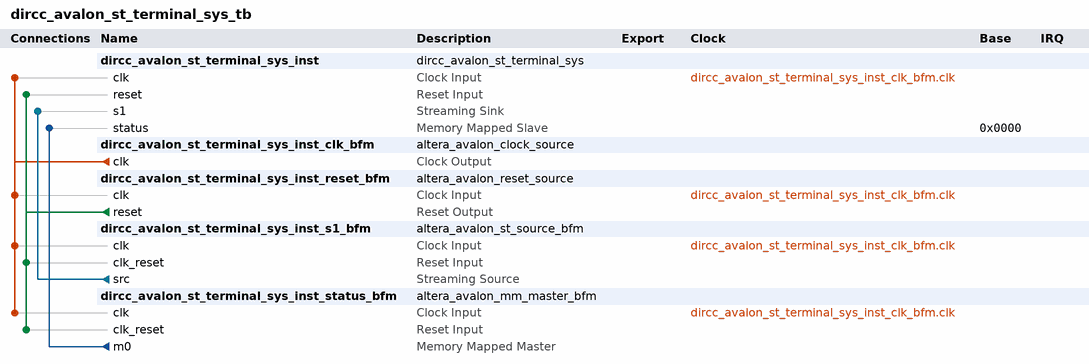
[diagram p0: system contents]
# Platform Designer (Qsys) system dircc_avalon_st_terminal_sys_tb, Cyclone V 5CSEMA5F31C6
# Parameters at their usual value, and those the tool derives, are not listed.
package require -exact qsys 16.1
create_system dircc_avalon_st_terminal_sys_tb
set_project_property DEVICE_FAMILY {Cyclone V}
set_project_property DEVICE 5CSEMA5F31C6

add_instance dircc_avalon_st_terminal_sys_inst dircc_avalon_st_terminal_sys 1.0

add_instance dircc_avalon_st_terminal_sys_inst_clk_bfm altera_avalon_clock_source 16.1

add_instance dircc_avalon_st_terminal_sys_inst_reset_bfm altera_avalon_reset_source 16.1
set_instance_parameter_value dircc_avalon_st_terminal_sys_inst_reset_bfm ASSERT_HIGH_RESET 0
set_instance_parameter_value dircc_avalon_st_terminal_sys_inst_reset_bfm INITIAL_RESET_CYCLES 50

add_instance dircc_avalon_st_terminal_sys_inst_s1_bfm altera_avalon_st_source_bfm 16.1
set_instance_parameter_value dircc_avalon_st_terminal_sys_inst_s1_bfm ST_CHANNEL_W 1
set_instance_parameter_value dircc_avalon_st_terminal_sys_inst_s1_bfm ST_ERROR_W 1
set_instance_parameter_value dircc_avalon_st_terminal_sys_inst_s1_bfm ST_MAX_CHANNELS 0
set_instance_parameter_value dircc_avalon_st_terminal_sys_inst_s1_bfm ST_NUMSYMBOLS 4
set_instance_parameter_value dircc_avalon_st_terminal_sys_inst_s1_bfm ST_SYMBOL_W 8
set_instance_parameter_value dircc_avalon_st_terminal_sys_inst_s1_bfm USE_CHANNEL 0
set_instance_parameter_value dircc_avalon_st_terminal_sys_inst_s1_bfm USE_EMPTY 1
set_instance_parameter_value dircc_avalon_st_terminal_sys_inst_s1_bfm USE_ERROR 0
set_instance_parameter_value dircc_avalon_st_terminal_sys_inst_s1_bfm USE_PACKET 1
set_instance_parameter_value dircc_avalon_st_terminal_sys_inst_s1_bfm USE_READY 1
set_instance_parameter_value dircc_avalon_st_terminal_sys_inst_s1_bfm USE_VALID 1

add_instance dircc_avalon_st_terminal_sys_inst_status_bfm altera_avalon_mm_master_bfm 16.1
set_instance_parameter_value dircc_avalon_st_terminal_sys_inst_status_bfm ADDRESS_UNITS WORDS
set_instance_parameter_value dircc_avalon_st_terminal_sys_inst_status_bfm AV_ADDRESS_W 2
set_instance_parameter_value dircc_avalon_st_terminal_sys_inst_status_bfm AV_ALWAYS_BURST_MAX_BURST 0
set_instance_parameter_value dircc_avalon_st_terminal_sys_inst_status_bfm AV_BURSTCOUNT_W 1
set_instance_parameter_value dircc_avalon_st_terminal_sys_inst_status_bfm AV_BURST_BNDR_ONLY 0
set_instance_parameter_value dircc_avalon_st_terminal_sys_inst_status_bfm AV_BURST_LINEWRAP 0
set_instance_parameter_value dircc_avalon_st_terminal_sys_inst_status_bfm AV_CONSTANT_BURST_BEHAVIOR 1
set_instance_parameter_value dircc_avalon_st_terminal_sys_inst_status_bfm AV_FIX_READ_LATENCY 0
set_instance_parameter_value dircc_avalon_st_terminal_sys_inst_status_bfm AV_MAX_PENDING_WRITES 0
set_instance_parameter_value dircc_avalon_st_terminal_sys_inst_status_bfm AV_NUMSYMBOLS 2
set_instance_parameter_value dircc_avalon_st_terminal_sys_inst_status_bfm AV_READRESPONSE_W 1
set_instance_parameter_value dircc_avalon_st_terminal_sys_inst_status_bfm AV_READ_WAIT_TIME 1
set_instance_parameter_value dircc_avalon_st_terminal_sys_inst_status_bfm AV_WRITERESPONSE_W 1
set_instance_parameter_value dircc_avalon_st_terminal_sys_inst_status_bfm USE_BURSTCOUNT 0
set_instance_parameter_value dircc_avalon_st_terminal_sys_inst_status_bfm USE_BYTE_ENABLE 0
set_instance_parameter_value dircc_avalon_st_terminal_sys_inst_status_bfm USE_READ 1
set_instance_parameter_value dircc_avalon_st_terminal_sys_inst_status_bfm USE_READ_DATA 1
set_instance_parameter_value dircc_avalon_st_terminal_sys_inst_status_bfm USE_READ_DATA_VALID 0
set_instance_parameter_value dircc_avalon_st_terminal_sys_inst_status_bfm USE_WAIT_REQUEST 0
set_instance_parameter_value dircc_avalon_st_terminal_sys_inst_status_bfm USE_WRITE 0
set_instance_parameter_value dircc_avalon_st_terminal_sys_inst_status_bfm USE_WRITE_DATA 0
set_instance_parameter_value dircc_avalon_st_terminal_sys_inst_status_bfm VHDL_ID 0

# connections
add_connection dircc_avalon_st_terminal_sys_inst_clk_bfm.clk dircc_avalon_st_terminal_sys_inst.clk clock
add_connection dircc_avalon_st_terminal_sys_inst_clk_bfm.clk dircc_avalon_st_terminal_sys_inst_reset_bfm.clk clock
add_connection dircc_avalon_st_terminal_sys_inst_clk_bfm.clk dircc_avalon_st_terminal_sys_inst_s1_bfm.clk clock
add_connection dircc_avalon_st_terminal_sys_inst_clk_bfm.clk dircc_avalon_st_terminal_sys_inst_status_bfm.clk clock
add_connection dircc_avalon_st_terminal_sys_inst_reset_bfm.reset dircc_avalon_st_terminal_sys_inst.reset reset
add_connection dircc_avalon_st_terminal_sys_inst_reset_bfm.reset dircc_avalon_st_terminal_sys_inst_s1_bfm.clk_reset reset
add_connection dircc_avalon_st_terminal_sys_inst_reset_bfm.reset dircc_avalon_st_terminal_sys_inst_status_bfm.clk_reset reset
add_connection dircc_avalon_st_terminal_sys_inst_status_bfm.m0 dircc_avalon_st_terminal_sys_inst.status avalon
set_connection_parameter_value dircc_avalon_st_terminal_sys_inst_status_bfm.m0/dircc_avalon_st_terminal_sys_inst.status baseAddress 0x0000
add_connection dircc_avalon_st_terminal_sys_inst_s1_bfm.src dircc_avalon_st_terminal_sys_inst.s1 avalon_streaming

set_interconnect_requirement {$system} qsys_mm.clockCrossingAdapter HANDSHAKE
set_interconnect_requirement {$system} qsys_mm.enableEccProtection FALSE
set_interconnect_requirement {$system} qsys_mm.insertDefaultSlave FALSE
set_interconnect_requirement {$system} qsys_mm.maxAdditionalLatency 1

save_system dircc_avalon_st_terminal_sys_tb.qsys
